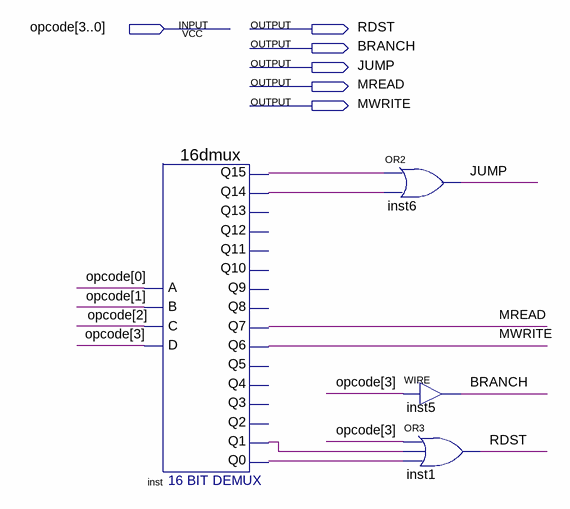
[diagram p0: schematic sheet]
// Quartus schematic Control2.bdf as structural Verilog: 4 symbols, 6 pins
module Control2 (
  input  [3:0] opcode,
  output RDST,
  output BRANCH,
  output JUMP,
  output MREAD,
  output MWRITE
);

  wire inst_q0, inst_q1, inst_q14, inst_q15;

  \16dmux  inst (
    .C(opcode[2]), .B(opcode[1]), .A(opcode[0]), .D(opcode[3]), .Q7(MREAD), .Q6(MWRITE), .Q14(inst_q14),
    .Q15(inst_q15), .Q0(inst_q0), .Q1(inst_q1));  // open: Q12, Q13, Q11, Q9, Q10, Q8, Q4, Q5, Q2, Q3
  or inst6 (JUMP, inst_q15, inst_q14);
  assign BRANCH = opcode[3];  // WIRE inst5
  or inst1 (RDST, opcode[3], inst_q1, inst_q0);
endmodule
